# Altium schematic sheet GPIO_OUT.SchDoc
size B
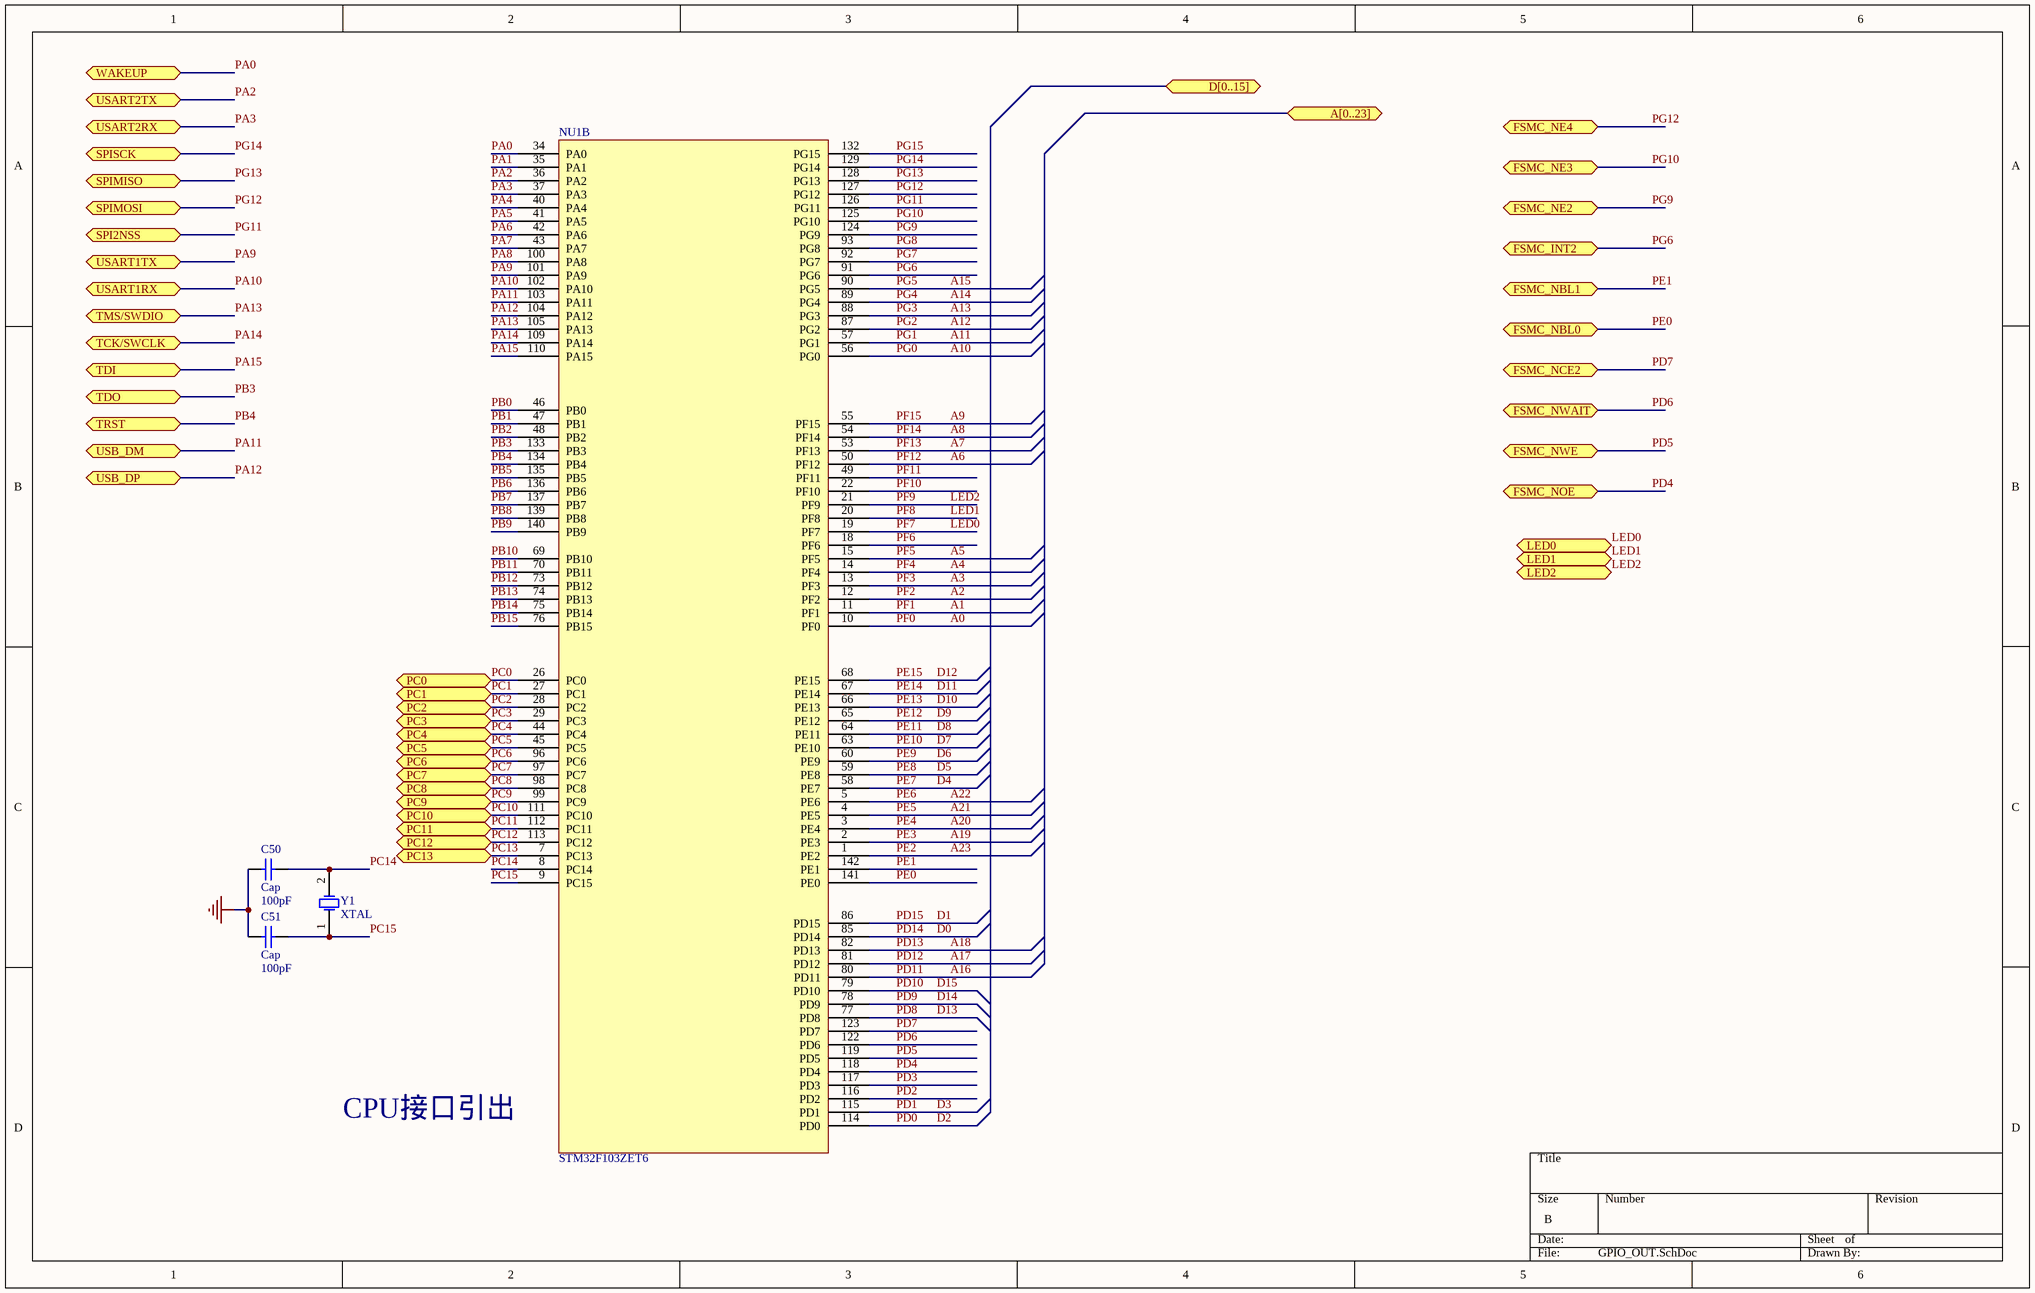
[diagram p0: GPIO_OUT.SchDoc]

## Parts
C50  Cap  value 100pF  [0805]
C51  Cap  value 100pF  [0805]
NU1  STM32F103ZET6  (part B of 3)
Y1  XTAL  [XTAL-1]

## Ports
A[0..23] (bidir), D[0..15] (bidir), FSMC_INT2 (bidir), FSMC_NBL0 (bidir), FSMC_NBL1 (bidir), FSMC_NCE2 (bidir), FSMC_NE2 (bidir), FSMC_NE3 (bidir), FSMC_NE4 (bidir), FSMC_NOE (bidir), FSMC_NWAIT (bidir), FSMC_NWE (bidir), LED0 (bidir), LED1 (bidir), LED2 (bidir), PC0 (bidir), PC1 (bidir), PC2 (bidir), PC3 (bidir), PC4 (bidir), PC5 (bidir), PC6 (bidir), PC7 (bidir), PC8 (bidir), PC9 (bidir), PC10 (bidir), PC11 (bidir), PC12 (bidir), PC13 (bidir), SPI2NSS (bidir), SPIMISO (bidir), SPIMOSI (bidir), SPISCK (bidir), TCK/SWCLK (bidir), TDI (bidir), TDO (bidir), TMS/SWDIO (bidir), TRST (bidir), USART1RX (bidir), USART1TX (bidir), USART2RX (bidir), USART2TX (bidir), USB_DM (bidir), USB_DP (bidir), WAKEUP (bidir)

## Nets
GND: C50.1 C51.1
A0: NU1.10(PF0)  [also labelled PF0]
A1: NU1.11(PF1)  [also labelled PF1]
A2: NU1.12(PF2)  [also labelled PF2]
A3: NU1.13(PF3)  [also labelled PF3]
A4: NU1.14(PF4)  [also labelled PF4]
A5: NU1.15(PF5)  [also labelled PF5]
A6: NU1.50(PF12)  [also labelled PF12]
A7: NU1.53(PF13)  [also labelled PF13]
A8: NU1.54(PF14)  [also labelled PF14]
A9: NU1.55(PF15)  [also labelled PF15]
A10: NU1.56(PG0)  [also labelled PG0]
A11: NU1.57(PG1)  [also labelled PG1]
A12: NU1.87(PG2)  [also labelled PG2]
A13: NU1.88(PG3)  [also labelled PG3]
A14: NU1.89(PG4)  [also labelled PG4]
A15: NU1.90(PG5)  [also labelled PG5]
A16: NU1.80(PD11)  [also labelled PD11]
A17: NU1.81(PD12)  [also labelled PD12]
A18: NU1.82(PD13)  [also labelled PD13]
A19: NU1.2(PE3)  [also labelled PE3]
A20: NU1.3(PE4)  [also labelled PE4]
A21: NU1.4(PE5)  [also labelled PE5]
A22: NU1.5(PE6)  [also labelled PE6]
A23: NU1.1(PE2)  [also labelled PE2]
D0: NU1.85(PD14)  [also labelled PD14]
D1: NU1.86(PD15)  [also labelled PD15]
D2: NU1.114(PD0)  [also labelled PD0]
D3: NU1.115(PD1)  [also labelled PD1]
D4: NU1.58(PE7)  [also labelled PE7]
D5: NU1.59(PE8)  [also labelled PE8]
D6: NU1.60(PE9)  [also labelled PE9]
D7: NU1.63(PE10)  [also labelled PE10]
D8: NU1.64(PE11)  [also labelled PE11]
D9: NU1.65(PE12)  [also labelled PE12]
D10: NU1.66(PE13)  [also labelled PE13]
D11: NU1.67(PE14)  [also labelled PE14]
D12: NU1.68(PE15)  [also labelled PE15]
D13: NU1.77(PD8)  [also labelled PD8]
D14: NU1.78(PD9)  [also labelled PD9]
D15: NU1.79(PD10)  [also labelled PD10]
LED0: NU1.19(PF7) ; port LED0  [also labelled PF7]
LED1: NU1.20(PF8) ; port LED1  [also labelled PF8]
LED2: NU1.21(PF9) ; port LED2  [also labelled PF9]
PA0: NU1.34(PA0) ; port WAKEUP
PA1: NU1.35(PA1)
PA2: NU1.36(PA2) ; port USART2TX
PA3: NU1.37(PA3) ; port USART2RX
PA4: NU1.40(PA4)
PA5: NU1.41(PA5)
PA6: NU1.42(PA6)
PA7: NU1.43(PA7)
PA8: NU1.100(PA8)
PA9: NU1.101(PA9) ; port USART1TX
PA10: NU1.102(PA10) ; port USART1RX
PA11: NU1.103(PA11) ; port USB_DM
PA12: NU1.104(PA12) ; port USB_DP
PA13: NU1.105(PA13) ; port TMS/SWDIO
PA14: NU1.109(PA14) ; port TCK/SWCLK
PA15: NU1.110(PA15) ; port TDI
PB0: NU1.46(PB0)
PB1: NU1.47(PB1)
PB2: NU1.48(PB2)
PB3: NU1.133(PB3) ; port TDO
PB4: NU1.134(PB4) ; port TRST
PB5: NU1.135(PB5)
PB6: NU1.136(PB6)
PB7: NU1.137(PB7)
PB8: NU1.139(PB8)
PB9: NU1.140(PB9)
PB10: NU1.69(PB10)
PB11: NU1.70(PB11)
PB12: NU1.73(PB12)
PB13: NU1.74(PB13)
PB14: NU1.75(PB14)
PB15: NU1.76(PB15)
PC0: NU1.26(PC0) ; port PC0
PC1: NU1.27(PC1) ; port PC1
PC2: NU1.28(PC2) ; port PC2
PC3: NU1.29(PC3) ; port PC3
PC4: NU1.44(PC4) ; port PC4
PC5: NU1.45(PC5) ; port PC5
PC6: NU1.96(PC6) ; port PC6
PC7: NU1.97(PC7) ; port PC7
PC8: NU1.98(PC8) ; port PC8
PC9: NU1.99(PC9) ; port PC9
PC10: NU1.111(PC10) ; port PC10
PC11: NU1.112(PC11) ; port PC11
PC12: NU1.113(PC12) ; port PC12
PC13: NU1.7(PC13) ; port PC13
PC14: C50.2 NU1.8(PC14) Y1.2(OSC2)
PC15: C51.2 NU1.9(PC15) Y1.1(OSC1)
PD2: NU1.116(PD2)
PD3: NU1.117(PD3)
PD4: NU1.118(PD4) ; port FSMC_NOE
PD5: NU1.119(PD5) ; port FSMC_NWE
PD6: NU1.122(PD6) ; port FSMC_NWAIT
PD7: NU1.123(PD7) ; port FSMC_NCE2
PE0: NU1.141(PE0) ; port FSMC_NBL0
PE1: NU1.142(PE1) ; port FSMC_NBL1
PF6: NU1.18(PF6)
PF10: NU1.22(PF10)
PF11: NU1.49(PF11)
PG6: NU1.91(PG6) ; port FSMC_INT2
PG7: NU1.92(PG7)
PG8: NU1.93(PG8)
PG9: NU1.124(PG9) ; port FSMC_NE2
PG10: NU1.125(PG10) ; port FSMC_NE3
PG11: NU1.126(PG11) ; port SPI2NSS
PG12: NU1.127(PG12) ; port SPIMOSI, port FSMC_NE4
PG13: NU1.128(PG13) ; port SPIMISO
PG14: NU1.129(PG14) ; port SPISCK
PG15: NU1.132(PG15)

## Notes on the sheet
- CPU接口引出

## Library data of the parts
C50 C51 = Cap: Capacitor; Published: 8-Jun-2000; LatestRevisionDate: 17-Jul-2002; LatestRevisionNote: Re-released for DXP Platform.; PackageReference: RAD-0.3; Publisher: Altium Limited
Y1 = XTAL: Crystal Oscillator; Published: 8-Jun-2000; LatestRevisionDate: 17-Jul-2002; LatestRevisionNote: Re-released for DXP Platform.; PackageReference: R38; Publisher: Altium Limited